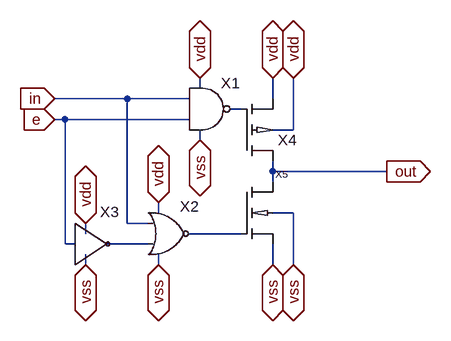
[diagram p0: schematic tri_state_buffer.asc]
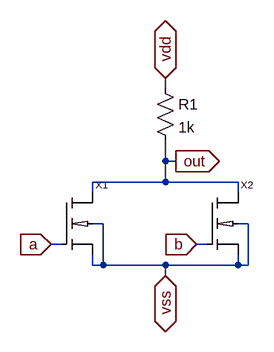
[diagram p1: sub-circuit nor.asc]
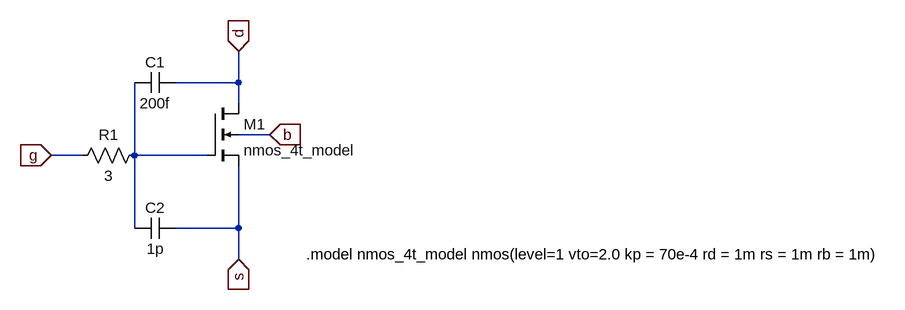
[diagram p2: sub-circuit nmos_4t.asc]
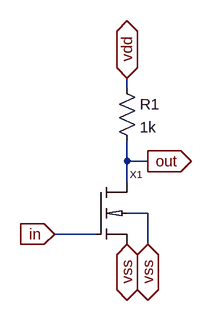
[diagram p3: sub-circuit not.asc]
tri_state_buffer.asc, the LTspice schematic file:
Version 4
SHEET 1 880 680
WIRE 112 48 112 32
WIRE 0 64 -112 64
WIRE 96 64 0 64
WIRE 224 64 224 32
WIRE 176 80 160 80
WIRE -96 96 -112 96
WIRE 96 96 -96 96
WIRE 256 112 256 32
WIRE 256 112 224 112
WIRE 112 128 112 112
WIRE 224 176 224 160
WIRE 400 176 224 176
WIRE 224 192 224 176
WIRE 48 240 48 224
WIRE 256 240 224 240
WIRE 0 256 0 64
WIRE 32 256 0 256
WIRE -64 272 -64 256
WIRE 176 272 96 272
WIRE -96 288 -96 96
WIRE -80 288 -96 288
WIRE 32 288 -32 288
WIRE -64 320 -64 304
WIRE 48 320 48 304
WIRE 224 320 224 288
WIRE 256 320 256 240
FLAG -112 64 in
IOPIN -112 64 In
FLAG -112 96 e
IOPIN -112 96 In
FLAG 224 320 vss
IOPIN 224 320 BiDir
FLAG 224 32 vdd
IOPIN 224 32 BiDir
FLAG 400 176 out
IOPIN 400 176 Out
FLAG -64 320 vss
IOPIN -64 320 BiDir
FLAG 48 320 vss
IOPIN 48 320 BiDir
FLAG 112 128 vss
IOPIN 112 128 BiDir
FLAG 112 32 vdd
IOPIN 112 32 BiDir
FLAG 48 224 vdd
IOPIN 48 224 BiDir
FLAG -64 256 vdd
IOPIN -64 256 BiDir
FLAG 256 32 vdd
IOPIN 256 32 BiDir
FLAG 256 320 vss
IOPIN 256 320 BiDir
SYMBOL nand 128 16 R0
SYMATTR InstName X1
SYMBOL nor 64 208 R0
WINDOW 0 17 22 Left 2
SYMATTR InstName X2
SYMBOL not -80 288 R0
WINDOW 0 53 -34 Bottom 2
SYMATTR InstName X3
SYMBOL pmos_4t 176 160 M180
SYMATTR InstName X4
SYMBOL nmos_4t 176 192 R0
SYMATTR InstName X5

nor.asc, the sub-circuit schematic file:
Version 4
SHEET 1 880 680
WIRE 240 48 240 32
WIRE 240 160 240 128
WIRE 256 160 240 160
WIRE 240 192 240 160
WIRE 240 192 128 192
WIRE 352 192 240 192
WIRE 128 208 128 192
WIRE 352 208 352 192
WIRE 144 256 128 256
WIRE 368 256 352 256
WIRE 80 288 64 288
WIRE 304 288 288 288
WIRE 128 320 128 304
WIRE 144 320 144 256
WIRE 144 320 128 320
WIRE 240 320 144 320
WIRE 352 320 352 304
WIRE 352 320 240 320
WIRE 368 320 368 256
WIRE 368 320 352 320
WIRE 240 336 240 320
FLAG 240 32 vdd
IOPIN 240 32 BiDir
FLAG 240 336 vss
IOPIN 240 336 BiDir
FLAG 256 160 out
IOPIN 256 160 Out
FLAG 288 288 b
IOPIN 288 288 In
FLAG 64 288 a
IOPIN 64 288 In
SYMBOL res 224 32 R0
SYMATTR InstName R1
SYMATTR Value 1k
SYMBOL nmos_4t 80 208 R0
SYMATTR InstName X1
SYMBOL nmos_4t 304 208 R0
SYMATTR InstName X2

nmos_4t.asc, the sub-circuit schematic file:
Version 4
SHEET 1 880 680
WIRE -288 -224 -288 -272
WIRE -288 -224 -384 -224
WIRE -288 -192 -288 -224
WIRE -240 -144 -288 -144
WIRE -528 -112 -576 -112
WIRE -448 -112 -448 -224
WIRE -336 -112 -448 -112
WIRE -448 0 -448 -112
WIRE -288 0 -288 -96
WIRE -288 0 -384 0
WIRE -288 48 -288 0
FLAG -576 -112 g
IOPIN -576 -112 In
FLAG -288 -272 d
IOPIN -288 -272 In
FLAG -288 48 s
IOPIN -288 48 In
FLAG -240 -144 b
IOPIN -240 -144 In
SYMBOL nmos4 -336 -192 R0
SYMATTR InstName M1
SYMATTR Value nmos_4t_model
SYMBOL cap -384 -240 R90
WINDOW 0 0 32 VBottom 2
WINDOW 3 32 32 VTop 2
SYMATTR InstName C1
SYMATTR Value 200f
SYMBOL cap -384 -16 R90
WINDOW 0 0 32 VBottom 2
WINDOW 3 32 32 VTop 2
SYMATTR InstName C2
SYMATTR Value 1p
SYMBOL res -432 -128 R90
WINDOW 0 0 56 VBottom 2
WINDOW 3 32 56 VTop 2
SYMATTR InstName R1
SYMATTR Value 3
TEXT -184 40 Left 2 !.model nmos_4t_model nmos(level=1 vto=2.0 kp = 70e-4 rd = 1m rs = 1m rb = 1m)

not.asc, the sub-circuit schematic file:
Version 4
SHEET 1 880 680
WIRE 176 -96 176 -112
WIRE 176 16 176 -16
WIRE 208 16 176 16
WIRE 176 48 176 16
WIRE 208 96 176 96
WIRE 128 128 64 128
WIRE 208 144 208 96
FLAG 64 128 in
IOPIN 64 128 In
FLAG 176 144 vss
IOPIN 176 144 BiDir
FLAG 176 -112 vdd
IOPIN 176 -112 BiDir
FLAG 208 16 out
IOPIN 208 16 Out
FLAG 208 144 vss
IOPIN 208 144 BiDir
SYMBOL res 160 -112 R0
SYMATTR InstName R1
SYMATTR Value 1k
SYMBOL nmos_4t 128 48 R0
SYMATTR InstName X1

The netlist it stands for:
* tri_state_buffer.asc
XX1 in e vdd vss N001 nand  ; pins a b vdd vss out
XX2 in N003 vdd vss N002 nor
XX3 e N003 vss vdd not
XX4 out N001 vdd vdd pmos_4t  ; pins D G S B
XX5 out N002 vss vss nmos_4t

* block symbol definitions
.subckt nor a b vdd vss out
R1 vdd out 1k
XX1 out a vss vss nmos_4t
XX2 out b vss vss nmos_4t
.ends nor

.subckt nmos_4t D G S B
M1 d N001 s b nmos_4t_model
C1 d N001 200f
C2 s N001 1p
R1 N001 g 3
.model nmos_4t_model nmos(level=1 vto=2.0 kp = 70e-4 rd = 1m rs = 1m rb = 1m)
.ends nmos_4t

.subckt not in out vss vdd
R1 vdd out 1k
XX1 out in vss vss nmos_4t
.ends not

.model NMOS NMOS
.model PMOS PMOS
.lib standard.mos
.backanno
.end